# EAGLE design attinier84-2digit-shield-mk-1.0 (EAGLE 6.5.0)
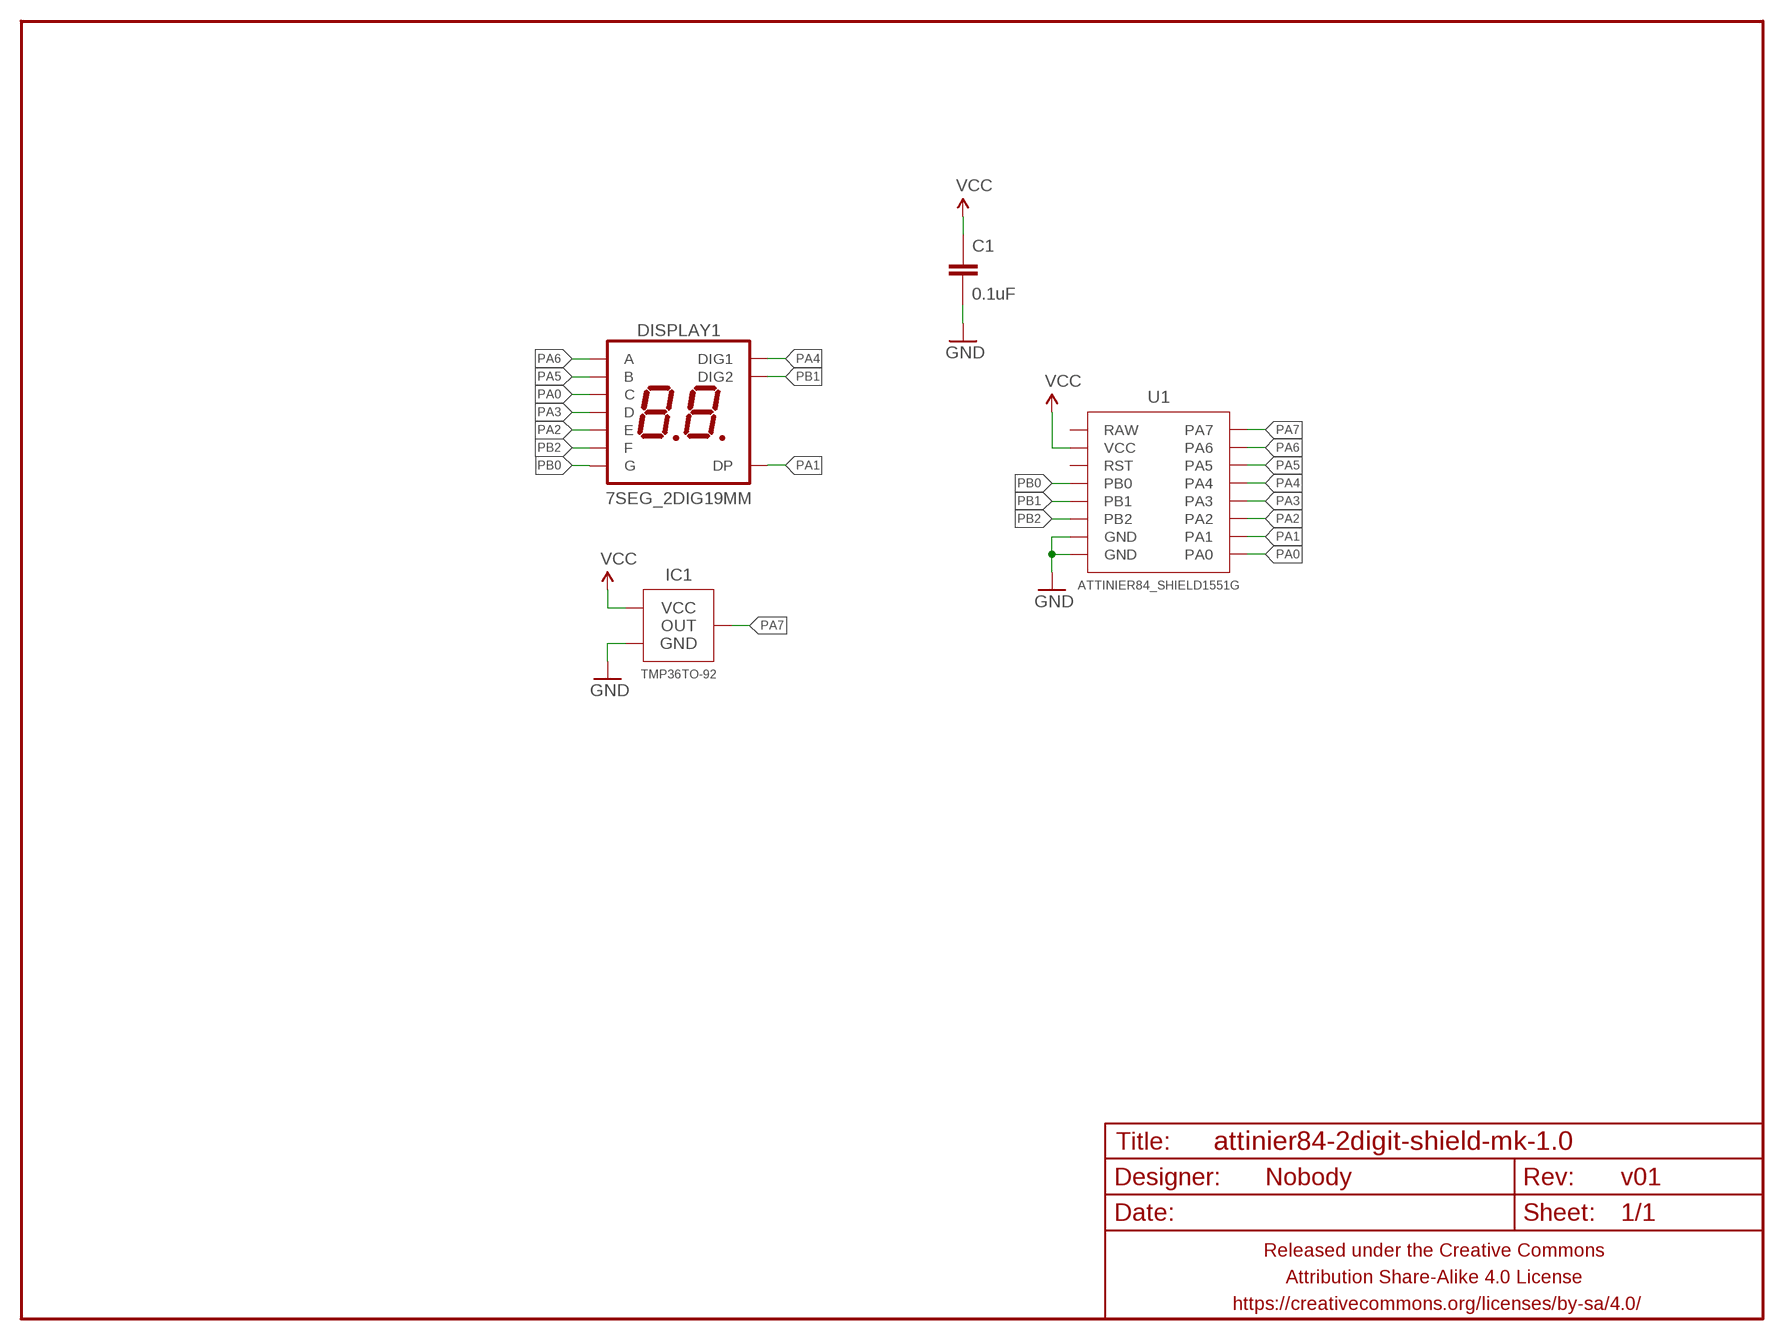
[diagram p0: schematic, sheet 1]

## Parts
C1  0.1uF  CAPACITOR-CERAMIC025-024X044  [C025-024X044]
DISPLAY1  7SEG_2DIG19MM  [7SEG_2DIG_19MM]
FRAME1  FRAME-LETTERNO_PACKAGE  [DUMMY]
IC1  TMP36TO-92  [TO-92-AMMO]
U1  ATTINIER84_SHIELD1551G  [ATTINIER84_SHIELD2]

## Nets
GND: C1.2 IC1.3(GND) U1.GND@1(GND) U1.GND@2(GND)
PA0: DISPLAY1.1(C) U1.PA0
PA1: DISPLAY1.2(DP) U1.PA1
PA2: DISPLAY1.3(E) U1.PA2
PA3: DISPLAY1.4(D) U1.PA3
PA4: DISPLAY1.8(DIG1) U1.PA4
PA5: DISPLAY1.9(B) U1.PA5
PA6: DISPLAY1.10(A) U1.PA6
PA7: IC1.2(OUT) U1.PA7
PB0: DISPLAY1.5(G) U1.PB0
PB1: DISPLAY1.7(DIG2) U1.PB1
PB2: DISPLAY1.6(F) U1.PB2
VCC: C1.1 IC1.1(VCC) U1.VCC
Unconnected: U1.RAW U1.RST

## Library data of the parts
C1 = A_butts:CAPACITOR-CERAMIC: CAPACITOR, European symbol
DISPLAY1 = A_butts:7SEG_2DIG
FRAME1 = A_butts:FRAME-LETTER: Schematic Frame Standard 8.5x11 US Letter frame; DESIGNER: Nobody; VERSION: v01
IC1 = A_butts:TMP36
U1 = A_butts:ATTINIER84_SHIELD

## Board
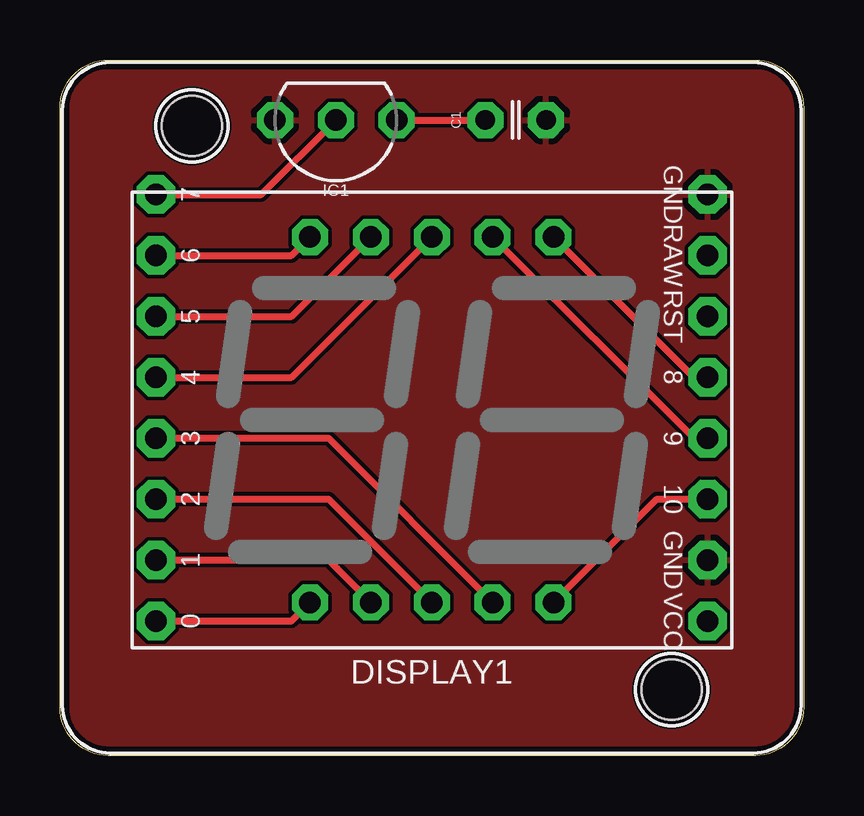
[diagram p1: board, top side]
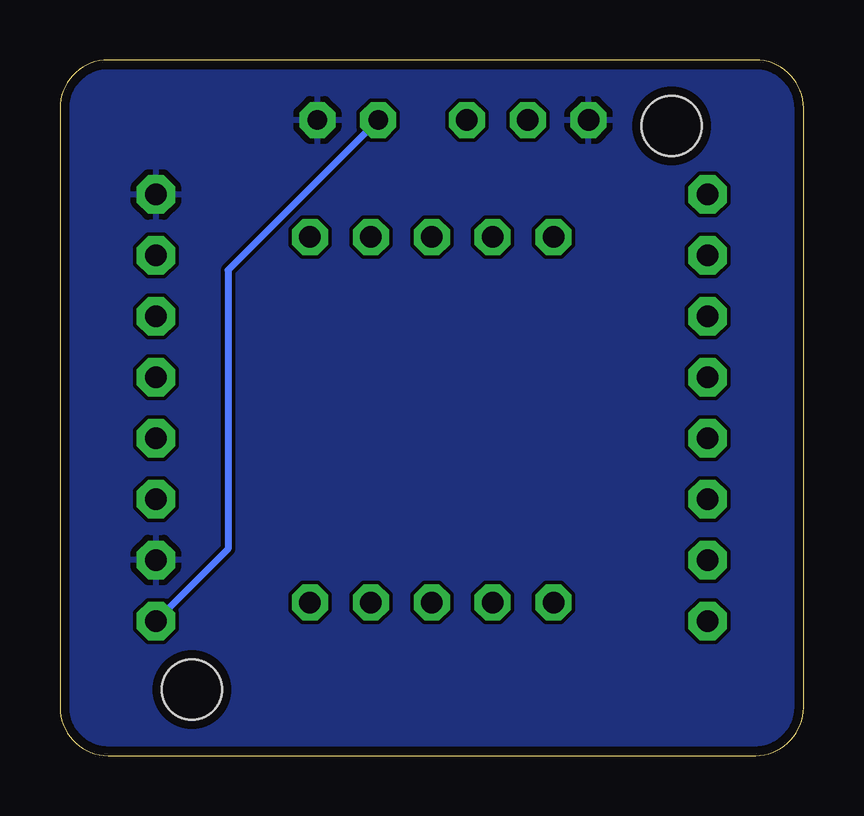
[diagram p2: board, bottom side, seen from below]

Size 31 x 29 mm. Coordinates in mm from the lower left corner, seen from the top.
Copper layers (1*16): Top 0.0356mm / dielectric 1.5011mm / Bottom 0.0356mm
Design rules "LaenPCBOrder_2": minimum track width 6mil, minimum drill 13mil, track to track 6mil, track to pad 6mil, pad to pad 6mil, via to via 6mil, smd to smd 6mil, copper to edge 15mil, drill to drill 6mil, minimum pad ring 7mil, minimum via ring 7mil, stop-mask expansion 3mil, vias tented up to drill 20mil, thermal gap 10mil

### Footprints (pad centres in the part's own frame; a part is rotated, then mirrored left to right if it is on the bottom)
C025-024X044 = drill 0.813 pad 1.5 octagon: 1 -1.27,0; 2 1.27,0
7SEG_2DIG_19MM = drill 0.9 pad 1.5 octagon: 1 -5.08,-7.62; 2 -2.54,-7.62; 3 0,-7.62; 4 2.54,-7.62; 5 5.08,-7.62; 6 5.08,7.62; 7 2.54,7.62; 8 0,7.62; 9 -2.54,7.62; 10 -5.08,7.62
TO-92-AMMO = drill 0.9 pad 1.5 octagon: 1 -2.54,0; 2 0,0; 3 2.54,0
ATTINIER84_SHIELD2 = drill 0.9 pad 1.6 octagon: GND@1 11.5,-6.35; GND@2 11.5,8.89; PA0 -11.5,-8.89; PA1 -11.5,-6.35; PA2 -11.5,-3.81; PA3 -11.5,-1.27; PA4 -11.5,1.27; PA5 -11.5,3.81; PA6 -11.5,6.35; PA7 -11.5,8.89; PB0 11.5,-3.81; PB1 11.5,-1.27; PB2 11.5,1.27; RAW 11.5,6.35; RST 11.5,3.81; VCC 11.5,-8.89 | hole 2.5: -10,11.75; 10,-11.75

### Placement (x,y rotation side)
C1  19,26.5 0 top
DISPLAY1  15.5,14 0 top
FRAME1  0,0 0 top
IC1  11.5,26.5 180 top
U1  15.5,14.5 0 top

### Tracks (layer width: path | path; a pad name or v marks a point on that pad's centre or on a via)
GND
  pour Top: -0.1,-0.1 -0.1,29.1 31.1,29.1 31.1,-0.1
  pour Bottom: -0.1,-0.1 -0.1,29.1 31.1,29.1 31.1,-0.1
PA0
  Top 0.3: U1.PA0 9.65,5.61 DISPLAY1.1
PA1
  Top 0.3: U1.PA1 11.19,8.15 DISPLAY1.2
PA2
  Top 0.3: U1.PA2 11.19,10.69 DISPLAY1.3
PA3
  Top 0.3: U1.PA3 11.19,13.23 DISPLAY1.4
PA4
  Top 0.3: U1.PA4 9.65,15.77 DISPLAY1.8
PA5
  Top 0.3: U1.PA5 9.65,18.31 DISPLAY1.9
PA6
  Top 0.3: U1.PA6 9.65,20.85 DISPLAY1.10
PA7
  Top 0.3: U1.PA7 8.39,23.39 IC1.2
PB0
  Top 0.3: DISPLAY1.5 24.89,10.69 U1.PB0
PB1
  Top 0.3: DISPLAY1.7 26.43,13.23 U1.PB1
PB2
  Top 0.3: DISPLAY1.6 26.43,15.77 U1.PB2
VCC
  Top 0.3: IC1.1 C1.1
  Bottom 0.3: U1.VCC 24,8.61 24,20.23 C1.1